# EAGLE design board (EAGLE 6.5.0)
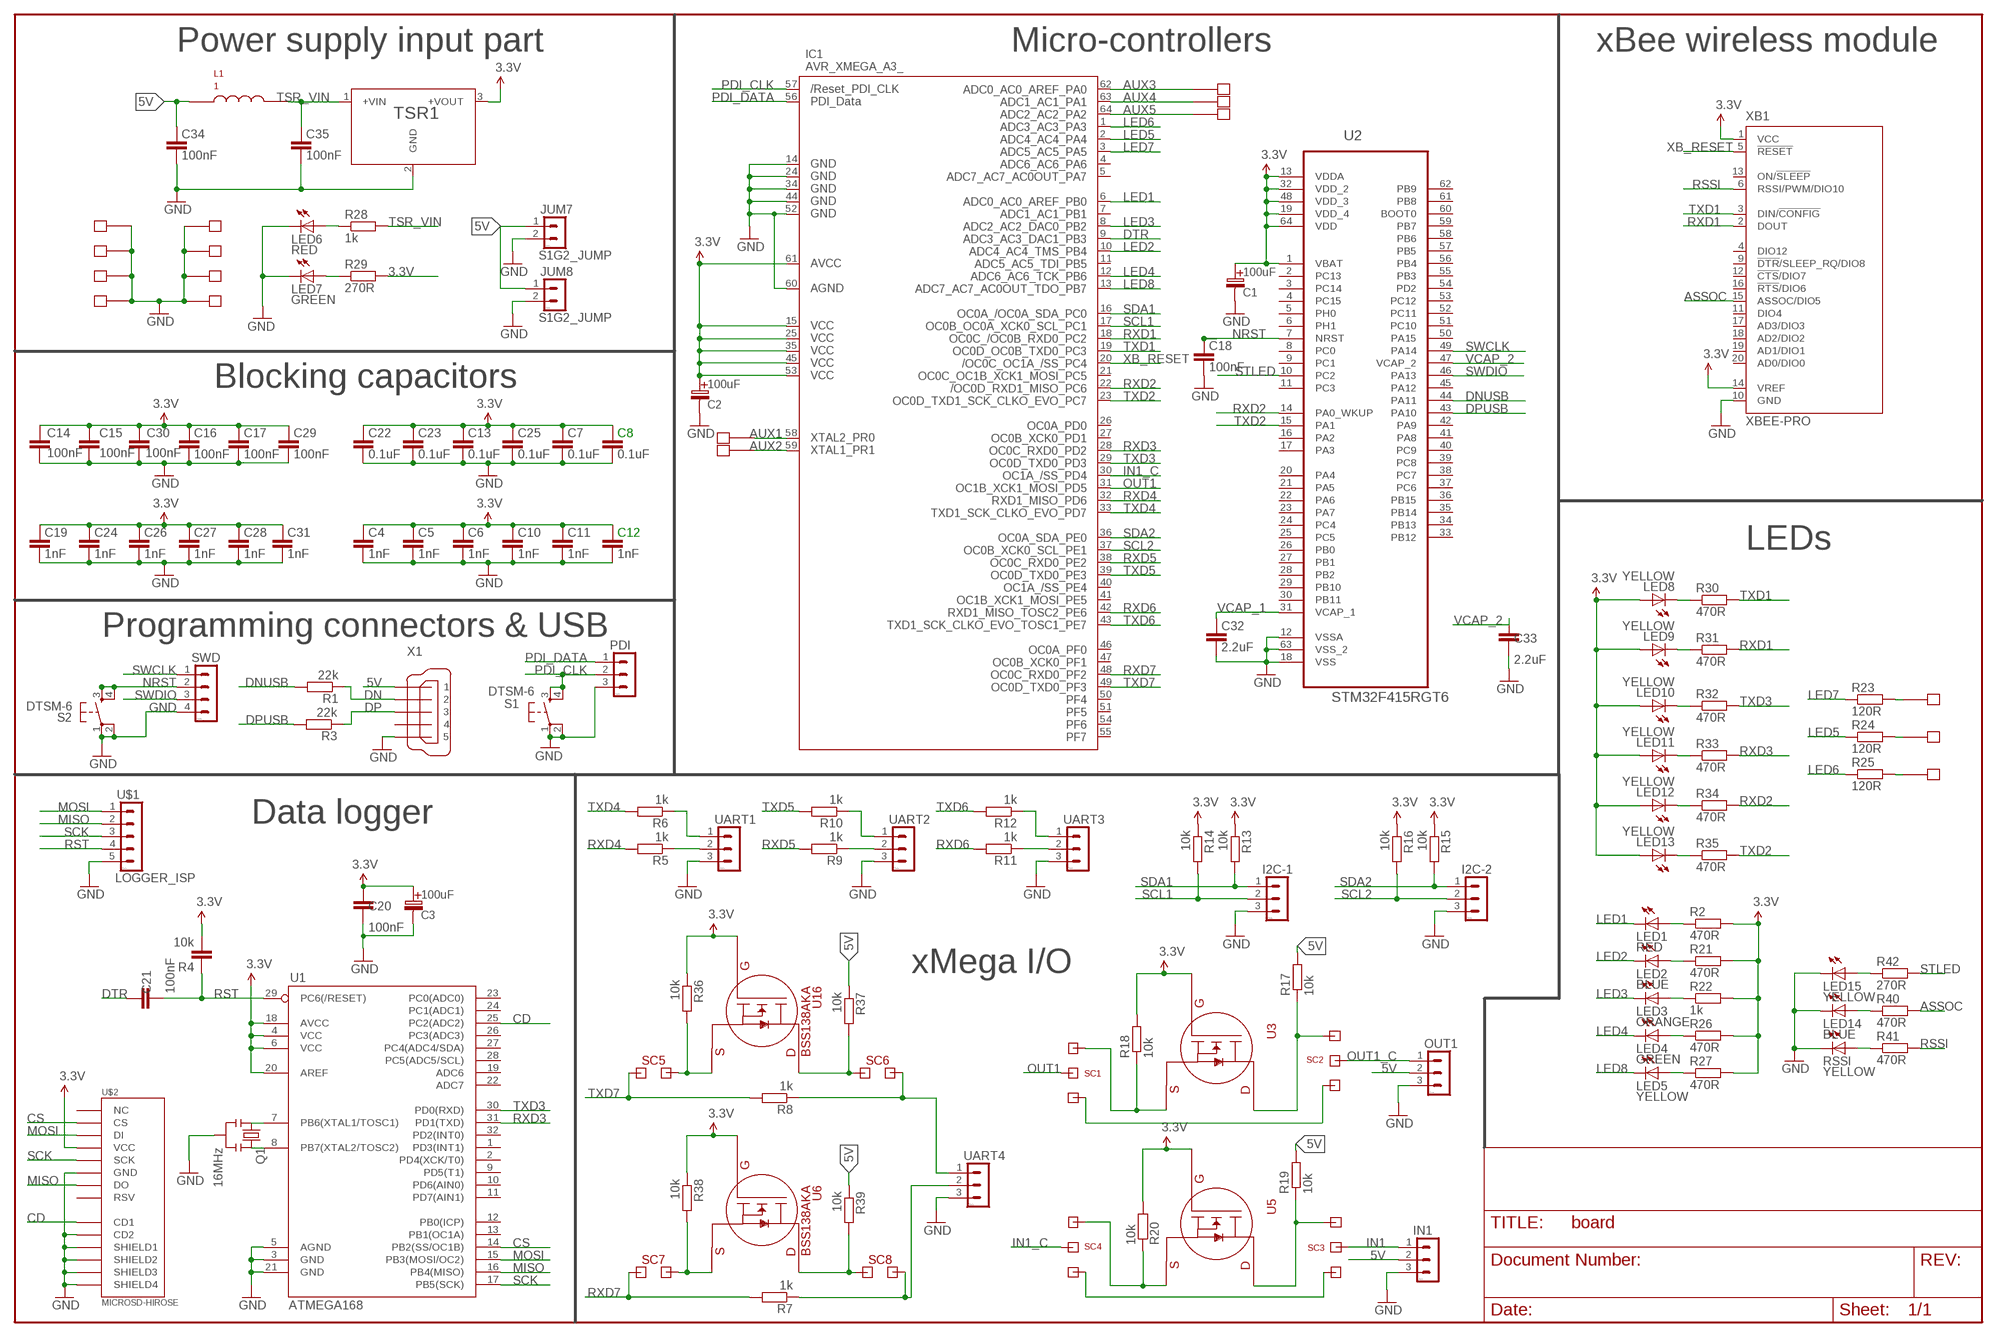
[diagram p0: schematic, sheet 1]

## Parts
AUX1  PIN  [PIN]
AUX2  PIN  [PIN]
AUX3  PIN  [PIN]
AUX4  PIN  [PIN]
AUX5  PIN  [PIN]
C1  100uF  CAPACITOR_TANTAL  [B]
C2  100uF  CAPACITOR_TANTAL  [B]
C3  100uF  CAPACITOR_TANTAL  [B]
C4  1nF  C-EUC0805  [C0805]
C5  1nF  C-EUC0805  [C0805]
C6  1nF  C-EUC0805  [C0805]
C7  0.1uF  C-EUC0805  [C0805]
C8  0.1uF  C-EUC0805  [C0805]
C10  1nF  C-EUC0805  [C0805]
C11  1nF  C-EUC0805  [C0805]
C12  1nF  C-EUC0805  [C0805]
C13  0.1uF  C-EUC0805  [C0805]
C14  100nF  C-EUC0805  [C0805]
C15  100nF  C-EUC0805  [C0805]
C16  100nF  C-EUC0805  [C0805]
C17  100nF  C-EUC0805  [C0805]
C18  100nF  C-EUC0805  [C0805]
C19  1nF  C-EUC0805  [C0805]
C20  100nF  C-EUC0805  [C0805]
C21  100nF  C-EUC0805  [C0805]
C22  0.1uF  C-EUC0805  [C0805]
C23  0.1uF  C-EUC0805  [C0805]
C24  1nF  C-EUC0805  [C0805]
C25  0.1uF  C-EUC0805  [C0805]
C26  1nF  C-EUC0805  [C0805]
C27  1nF  C-EUC0805  [C0805]
C28  1nF  C-EUC0805  [C0805]
C29  100nF  C-EUC0805  [C0805]
C30  100nF  C-EUC0805  [C0805]
C31  1nF  C-EUC0805  [C0805]
C32  2.2uF  C-EUC0805  [C0805]
C33  2.2uF  C-EUC0805  [C0805]
C34  100nF  C-EUC0805  [C0805]
C35  100nF  C-EUC0805  [C0805]
I2C-1  S1G3_JUMP  [S1G3_JUM]
I2C-2  S1G3_JUMP  [S1G3_JUM]
IC1  AVR_XMEGA_A3_  [TQFP64]
IN1  S1G3_JUMP  [S1G3_JUM]
JUM7  S1G2_JUMP  [S1G2_JUM]
JUM8  S1G2_JUMP  [S1G2_JUM]
L1  1  LSDR0604  [SDR0604]
LED1  RED  LEDSML0805  [SML0805]
LED2  BLUE  LEDSML0805  [SML0805]
LED3  ORANGE  LEDSML0805  [SML0805]
LED4  GREEN  LEDSML0805  [SML0805]
LED5  YELLOW  LEDSML0805  [SML0805]
LED6  RED  LEDSML0805  [SML0805]
LED7  GREEN  LEDSML0805  [SML0805]
LED8  YELLOW  LEDSML0805  [SML0805]
LED9  YELLOW  LEDSML0805  [SML0805]
LED10  YELLOW  LEDSML0805  [SML0805]
LED11  YELLOW  LEDSML0805  [SML0805]
LED12  YELLOW  LEDSML0805  [SML0805]
LED13  YELLOW  LEDSML0805  [SML0805]
LED14  BLUE  LEDSML0805  [SML0805]
LED15  YELLOW  LEDSML0805  [SML0805]
OUT1  S1G3_JUMP  [S1G3_JUM]
PDI  S1G3_JUMP  [S1G3_JUM]
Q1  16MHz  RESONATORSMD  [RESONATOR-SMD]
R1  22k  R-EU_R0805  [R0805]
R2  470R  R-EU_R0805  [R0805]
R3  22k  R-EU_R0805  [R0805]
R4  10k  C-EUC0805  [C0805]
R5  1k  R-EU_R0805  [R0805]
R6  1k  R-EU_R0805  [R0805]
R7  1k  R-EU_R0805  [R0805]
R8  1k  R-EU_R0805  [R0805]
R9  1k  R-EU_R0805  [R0805]
R10  1k  R-EU_R0805  [R0805]
R11  1k  R-EU_R0805  [R0805]
R12  1k  R-EU_R0805  [R0805]
R13  10k  R-EU_R0805  [R0805]
R14  10k  R-EU_R0805  [R0805]
R15  10k  R-EU_R0805  [R0805]
R16  10k  R-EU_R0805  [R0805]
R17  10k  R-EU_R0805  [R0805]
R18  10k  R-EU_R0805  [R0805]
R19  10k  R-EU_R0805  [R0805]
R20  10k  R-EU_R0805  [R0805]
R21  470R  R-EU_R0805  [R0805]
R22  1k  R-EU_R0805  [R0805]
R23  120R  R-EU_R0805  [R0805]
R24  120R  R-EU_R0805  [R0805]
R25  120R  R-EU_R0805  [R0805]
R26  470R  R-EU_R0805  [R0805]
R27  470R  R-EU_R0805  [R0805]
R28  1k  R-EU_R0805  [R0805]
R29  270R  R-EU_R0805  [R0805]
R30  470R  R-EU_R0805  [R0805]
R31  470R  R-EU_R0805  [R0805]
R32  470R  R-EU_R0805  [R0805]
R33  470R  R-EU_R0805  [R0805]
R34  470R  R-EU_R0805  [R0805]
R35  470R  R-EU_R0805  [R0805]
R36  10k  R-EU_R0805  [R0805]
R37  10k  R-EU_R0805  [R0805]
R38  10k  R-EU_R0805  [R0805]
R39  10k  R-EU_R0805  [R0805]
R40  470R  R-EU_R0805  [R0805]
R41  470R  R-EU_R0805  [R0805]
R42  270R  R-EU_R0805  [R0805]
RSSI  YELLOW  LEDSML0805  [SML0805]
S1  DTSM-6  [DTSM-6]
S2  DTSM-6  [DTSM-6]
SC1  SOLDER_SWITCH_ONE  [SOLDER_SWITCH]
SC2  SOLDER_SWITCH_TWO  [SOLDER_SWITCH]
SC3  SOLDER_SWITCH_ONE  [SOLDER_SWITCH]
SC4  SOLDER_SWITCH_TWO  [SOLDER_SWITCH]
SC5  SOLDER_SWITCH_2  [SOLDER_SWITCH_2]
SC6  SOLDER_SWITCH_2  [SOLDER_SWITCH_2]
SC7  SOLDER_SWITCH_2  [SOLDER_SWITCH_2]
SC8  SOLDER_SWITCH_2  [SOLDER_SWITCH_2]
SWD  S1G4_JUMP_SQUARE  [2X02]
TSR  TSR1  [TSR1]
U1  ATMEGA168  [TQFP32-08]
U2  STM32F415RGT6  [QFP50P1200X1200X160-64N]
U3  BSS138AKA  [SOT-23]
U5  BSS138AKA  [SOT-23]
U6  BSS138AKA  [SOT-23]
U16  BSS138AKA  [SOT-23]
U$1  LOGGER_ISP  [LOGGER_ISP]
U$2  MICROSD-HIROSE  [MICROSD_HOLDER-HIROSE-DM3AT]
U$10  PIN  [PIN]
U$11  PIN  [PIN]
U$12  PIN  [PIN]
U$15  PIN  [PIN]
U$16  PIN  [PIN]
U$17  PIN  [PIN]
U$18  PIN  [PIN]
U$19  PIN  [PIN]
U$20  PIN  [PIN]
U$21  PIN  [PIN]
U$22  PIN  [PIN]
UART1  S1G3_JUMP  [S1G3_JUM]
UART2  S1G3_JUMP  [S1G3_JUM]
UART3  S1G3_JUMP  [S1G3_JUM]
UART4  S1G3_JUMP  [S1G3_JUM]
X1  MINI-USB-UX60A-MB-5ST  [UX60A-MB-5ST]
XB1  XBEE-PRO  [XBEE-PRO]

## Nets
3.3V: C1.+(C_EL+) C2.+(C_EL+) C3.+(C_EL+) C4.2 C5.2 C6.2 C7.2 C8.2 C10.2 C11.2 C12.2 C13.2 C14.2 C15.2 C16.2 C17.2 C19.2 C20.2 C22.2 C23.2 C24.2 C25.2 C26.2 C27.2 C28.2 C29.2 C30.2 C31.2 IC1.15(VCC1) IC1.25(VCC2) IC1.35(VCC3) IC1.45(VCC4) IC1.53(VCC5) IC1.61(AVCC) LED8.A LED9.A LED10.A LED11.A LED12.A LED13.A R2.2 R4.2 R13.1 R14.1 R15.1 R16.1 R18.2 R20.2 R21.2 R22.2 R26.2 R27.2 R29.2 R36.1 R38.1 TSR.3(+VOUT) U1.4(VCC) U1.6(VCC) U1.18(AVCC) U1.20(AREF) U2.1(VBAT) U2.13(VDDA) U2.19(VDD_4) U2.32(VDD_2) U2.48(VDD_3) U2.64(VDD) U3.1(G) U5.1(G) U6.1(G) U16.1(G) U$2.VDD(VCC) XB1.1(VCC) XB1.14(VREF)
5V: C34.2 IN1.2 JUM7.1 JUM8.1 L1.P$1 OUT1.2 R17.2 R19.2 R37.1 R39.1 X1.1
ASSOC: R40.2 XB1.15(ASSOC/DIO5)
AUX1: AUX1.P$1(D) IC1.58(PR0)
AUX2: AUX2.P$1(D) IC1.59(PR1)
AUX3: AUX3.P$1(D) IC1.62(PA0)
AUX4: AUX4.P$1(D) IC1.63(PA1)
AUX5: AUX5.P$1(D) IC1.64(PA2)
CD: U1.25(PC2(ADC2)) U$2.CD1
CS: U1.14(PB2(SS/OC1B)) U$2.DAT3(CS)
DN: R1.1 X1.2
DNUSB: R1.2 U2.44(PA11)
DP: R3.1 X1.3
DPUSB: R3.2 U2.43(PA10)
DTR: C21.2 IC1.9(PB3)
GND [vcc]: C1.-(C_EL-) C2.-(C_EL-) C3.-(C_EL-) C4.1 C5.1 C6.1 C7.1 C8.1 C10.1 C11.1 C12.1 C13.1 C14.1 C15.1 C16.1 C17.1 C18.1 C19.1 C20.1 C22.1 C23.1 C24.1 C25.1 C26.1 C27.1 C28.1 C29.1 C30.1 C31.1 C32.1 C33.1 C34.1 C35.1 I2C-1.3 I2C-2.3 IC1.14(GND1) IC1.24(GND2) IC1.34(GND3) IC1.44(GND4) IC1.52(GND5) IC1.60(AGND) IN1.3 JUM7.2 JUM8.2 LED6.C LED7.C LED14.C LED15.C OUT1.3 PDI.3 Q1.2 RSSI.C S1.1 S1.2 S2.1 S2.2 SWD.4 TSR.2(GND) U1.3(GND) U1.5(AGND) U1.21(GND) U2.12(VSSA) U2.18(VSS) U2.63(VSS_2) U$1.5 U$2.BODY1(SHIELD1) U$2.BODY2(SHIELD2) U$2.BODY3(SHIELD3) U$2.BODY4(SHIELD4) U$2.CD2 U$2.VSS(GND) U$15.P$1(D) U$16.P$1(D) U$17.P$1(D) U$18.P$1(D) U$19.P$1(D) U$20.P$1(D) U$21.P$1(D) U$22.P$1(D) UART1.3 UART2.3 UART3.3 UART4.3 X1.5 XB1.10(GND)
IN1: IN1.1 SC3.MID
IN1_C: IC1.30(PD4) SC4.MID
LED1: IC1.6(PB0) LED1.C
LED2: IC1.10(PB4) LED2.C
LED3: IC1.8(PB2) LED3.C
LED4: IC1.12(PB6) LED4.C
LED5: IC1.2(PA4) R24.1
LED6: IC1.1(PA3) R25.1
LED7: IC1.3(PA5) R23.1
LED8: IC1.13(PB7) LED5.C
MISO: U1.16(PB4(MISO)) U$1.2 U$2.DAT0(DO)
MOSI: U1.15(PB3(MOSI/OC2)) U$1.1 U$2.CMD(DI)
N$1: Q1.3 U1.8(PB7(XTAL2/TOSC2))
N$2: Q1.1 U1.7(PB6(XTAL1/TOSC1))
N$3: LED1.A R2.1
N$4: R25.2 U$12.P$1(D)
N$5: R5.1 UART1.2
N$6: R6.1 UART1.1
N$7: LED3.A R22.1
N$8: R17.1 SC2.1 U3.3(D)
N$9: R18.1 SC1.1 U3.2(S)
N$10: R10.1 UART2.1
N$11: R9.1 UART2.2
N$12: R12.1 UART3.1
N$13: R11.1 UART3.2
N$14: LED8.C R30.1
N$15: R20.1 SC4.1 U5.2(S)
N$16: R36.2 SC5.1 U16.2(S)
N$17: LED6.A R28.1
N$18: LED2.A R21.1
N$19: LED7.A R29.1
N$20: LED4.A R26.1
N$21: LED9.C R31.1
N$22: R38.2 SC7.1 U6.2(S)
N$23: R37.2 SC6.MID U16.3(D)
N$24: LED10.C R32.1
N$25: R39.2 SC8.MID U6.3(D)
N$26: LED11.C R33.1
N$27: LED12.C R34.1
N$28: LED13.C R35.1
N$29: LED5.A R27.1
N$30: R19.1 SC3.1 U5.3(D)
N$31: SC3.2 SC4.2
N$32: R23.2 U$10.P$1(D)
N$33: LED14.A R40.1
N$34: SC1.2 SC2.2
N$35: R41.1 RSSI.A
N$36: R24.2 U$11.P$1(D)
N$37: LED15.A R42.1
NRST: C18.2 S2.3 S2.4 SWD.2 U2.7(NRST)
OUT1: IC1.31(PD5) SC1.MID
OUT1_C: OUT1.1 SC2.MID
PDI_CLK: IC1.57(RESET) PDI.2 S1.3 S1.4
PDI_DATA: IC1.56(PDI_DATA) PDI.1
RSSI: R41.2 XB1.6(RSSI/PWM/DIO10)
RST: C21.1 R4.1 U1.29(PC6(/RESET)) U$1.4
RXD1: IC1.18(PC2) R31.2 XB1.2(DOUT)
RXD2: IC1.22(PC6) R34.2 U2.14(PA0_WKUP)
RXD3: IC1.28(PD2) R33.2 U1.31(PD1(TXD))
RXD4: IC1.32(PD6) R5.2
RXD5: IC1.38(PE2) R9.2
RXD6: IC1.42(PE6) R11.2
RXD7: IC1.48(PF2) R7.2 SC7.MID
RXD77: R7.1 SC8.1 UART4.2
SCK: U1.17(PB5(SCK)) U$1.3 U$2.CLK(SCK)
SCL1: I2C-1.2 IC1.17(PC1) R14.2
SCL2: I2C-2.2 IC1.37(PE1) R16.2
SDA1: I2C-1.1 IC1.16(PC0) R13.2
SDA2: I2C-2.1 IC1.36(PE0) R15.2
STLED: R42.2 U2.10(PC2)
SWCLK: SWD.1 U2.49(PA14)
SWDIO: SWD.3 U2.46(PA13)
TSR_VIN: C35.2 L1.P$2 R28.2 TSR.1(+VIN)
TXD1: IC1.19(PC3) R30.2 XB1.3(DIN/!CONFIG)
TXD2: IC1.23(PC7) R35.2 U2.15(PA1)
TXD3: IC1.29(PD3) R32.2 U1.30(PD0(RXD))
TXD4: IC1.33(PD7) R6.2
TXD5: IC1.39(PE3) R10.2
TXD6: IC1.43(PE7) R12.2
TXD7: IC1.49(PF3) R8.2 SC5.MID
TXD77: R8.1 SC6.1 UART4.1
VCAP_1: C32.2 U2.31(VCAP_1)
VCAP_2: C33.2 U2.47(VCAP_2)
XB_RESET: IC1.20(PC4) XB1.5(!RESET)
Unconnected: IC1.4(PA6) IC1.5(PA7) IC1.7(PB1) IC1.11(PB5) IC1.21(PC5) IC1.26(PD0) IC1.27(PD1) IC1.40(PE4) IC1.41(PE5) IC1.46(PF0) IC1.47(PF1) IC1.50(PF4) IC1.51(PF5) IC1.54(PF6) IC1.55(PF7) U1.1(PD3(INT1)) U1.2(PD4(XCK/T0)) U1.9(PD5(T1)) U1.10(PD6(AIN0)) U1.11(PD7(AIN1)) U1.12(PB0(ICP)) U1.13(PB1(OC1A)) U1.19(ADC6) U1.22(ADC7) U1.23(PC0(ADC0)) U1.24(PC1(ADC1)) U1.26(PC3(ADC3)) U1.27(PC4(ADC4/SDA)) U1.28(PC5(ADC5/SCL)) U1.32(PD2(INT0)) U2.2(PC13) U2.3(PC14) U2.4(PC15) U2.5(PH0) U2.6(PH1) U2.8(PC0) U2.9(PC1) U2.11(PC3) U2.16(PA2) U2.17(PA3) U2.20(PA4) U2.21(PA5) U2.22(PA6) U2.23(PA7) U2.24(PC4) U2.25(PC5) U2.26(PB0) U2.27(PB1) U2.28(PB2) U2.29(PB10) U2.30(PB11) U2.33(PB12) U2.34(PB13) U2.35(PB14) U2.36(PB15) U2.37(PC6) U2.38(PC7) U2.39(PC8) U2.40(PC9) U2.41(PA8) U2.42(PA9) U2.45(PA12) U2.50(PA15) U2.51(PC10) U2.52(PC11) U2.53(PC12) U2.54(PD2) U2.55(PB3) U2.56(PB4) U2.57(PB5) U2.58(PB6) U2.59(PB7) U2.60(BOOT0) U2.61(PB8) U2.62(PB9) U$2.DAT1(RSV) U$2.DAT2(NC) X1.4 XB1.4(DIO12) XB1.9(!DTR!/SLEEP_RQ/DIO8) XB1.11(DIO4) XB1.12(!CTS!/DIO7) XB1.13(ON/!SLEEP) XB1.16(!RTS!/DIO6) XB1.17(AD3/DIO3) XB1.18(AD2/DIO2) XB1.19(AD1/DIO1) XB1.20(AD0/DIO0)

## Notes on the sheet
- Power supply input part | Micro-controllers | xBee wireless module
- Blocking capacitors
- LEDs
- Programming connectors & USB
- Data logger
- xMega I/O

## Library data of the parts
AUX1-AUX5 U$10-U$12 U$15-U$22 = #ControlBoardV2:PIN
C1-C3 = #ControlBoardV2:CAPACITOR_TANTAL
C4-C8 C10-C35 R4 = #ControlBoardV2:C-EU: CAPACITOR, European symbol
I2C-1 I2C-2 IN1 OUT1 PDI UART1-UART4 = #ControlBoardV2:S1G3_JUMP: Radove konektory - koliky - 3x
IC1 = xmega:AVR_XMEGA_A3_: Device for Atmel AVR XMEGA A3 Series
JUM7 JUM8 = #ControlBoardV1:S1G2_JUMP: Radove konektory - koliky - 2x
L1 = #ControlBoardV2:L
LED1-LED15 RSSI = #ControlBoardV1:LED: LED OSRAM: - CHIPLED LG R971, LG N971, LY N971, LG Q971, LY Q971, LO R971, LY R971 LH N974, LH R974 LS Q976, LO Q976, LY Q976 LO Q996 - Hyper CHIPLED LW Q18S LB Q993, LB Q99A, LB R99A - SideLED LS A670, LO A670, LY A670, LG A670, LP A670 LB A673, LV A673, LT A673, LW A673 LH A674 LY A675 LS A676, LA A676, LO A676, LY A676, LW A676 LS A679, LY A679, LG A679 - Hyper Micro SIDELED® LS Y876, LA Y876, LO Y876, LY Y876 LT Y87S - SmartLED LW L88C, LW L88S LB L89C, LB L89S, LG L890 LS L89K, LO L89K, LY L89K LS L896, LA L896, LO L896, LY L896 - TOPLED LS T670, LO T670, LY T670, LG T670, LP T670 LSG T670, LSP T670, LSY T670, LOP T670, LYG T670 LG T671, LOG T671, LSG T671 LB T673, LV T673, LT T673, LW T673 LH T674 LS T676, LA T676, LO T676, LY T676, LB T676, LH T676, LSB T676, LW T676 LB T67C, LV T67C, LT T67C, LS T67K, LO T67K, LY T67K, LW E67C LS E67B, LA E67B, LO E67B, LY E67B, LB E67C, LV E67C, LT E67C LW T67C LS T679, LY T679, LG T679 LS T770, LO T770, LY T770, LG T770, LP T770 LB T773, LV T773, LT T773, LW T773 LH T774 LS E675, LA E675, LY E675, LS T675 LS T776, LA T776, LO T776, LY T776, LB T776 LHGB T686 LT T68C, LB T68C - Hyper Mini TOPLED® LB M676 - Mini TOPLED Santana® LG M470 LS M47K, LO M47K, LY M47K Source: http://www.osram.convergy.de LUXEON: - LUMILED® LXK2-PW12-R00, LXK2-PW12-S00, LXK2-PW14-U00, LXK2-PW14-V00 LXK2-PM12-R00, LXK2-PM12-S00, LXK2-PM14-U00 LXK2-PE12-Q00, LXK2-PE12-R00, LXK2-PE12-S00, LXK2-PE14-T00, LXK2-PE14-U00 LXK2-PB12-K00, LXK2-PB12-L00, LXK2-PB12-M00, LXK2-PB14-N00, LXK2-PB14-P00, LXK2-PB14-Q00 LXK2-PR12-L00, LXK2-PR12-M00, LXK2-PR14-Q00, LXK2-PR14-R00 LXK2-PD12-Q00, LXK2-PD12-R00, LXK2-PD12-S00 LXK2-PH12-R00, LXK2-PH12-S00 LXK2-PL12-P00, LXK2-PL12-Q00, LXK2-PL12-R00 Source: www.luxeon.com KINGBRIGHT: KA-3528ASYC Source: www.kingbright.com
Q1 = #SparkFun:RESONATOR: Resonator Small SMD resonator. This is the itty bitty 10/20MHz resonators with built in caps. CSTCE10M0G55 and CSTCE20M0V53. Footprint has been reviewed closely but hasn't been tested yet.
R1-R3 R5-R42 = #ControlBoardV2:R-EU_: RESISTOR, European symbol
S1 S2 = #ControlBoardV1:DTSM-6
SC1-SC4 = #ControlBoardV2:SOLDER_SWITCH
SC5-SC8 = #ControlBoardV2:SOLDER_SWITCH_2
SWD = #ControlBoardV2:S1G4_JUMP: Radove konektory - koliky - 4x
TSR = #ControlBoardV2:TSR1
U1 = SparkFun:ATMEGA168
U2 = #ControlBoardV2:STM32F415RGT6: IC, MCU, 32BIT, 1MB FLASH, 64LQFP; MPN: STM32F415RGT6; OC_FARNELL: 2064370; OC_NEWARK: 73T2335; PACKAGE: 64LQFP; SUPPLIER: STMicroelectronics
U3 U5 = #ControlBoardV2:BSS138AKA: N MOSFET
U6 U16 = medipix:BSS138AKA: N MOSFET
U$1 = #ControlBoardV2:LOGGER_ISP: ISP programming interface for data logger
U$2 = basestation1:MICROSD-HIROSE
X1 = #ControlBoardV2:MINI-USB-: MINI USB Connector Source: http://www.hirose.co.jp/cataloge_hp/e24000019.pdf; OC_FARNELL: unknown; OC_NEWARK: unknown
XB1 = xbee:XBEE: XBee (TM) /XBee-PRO(TM) OEM RF Modules Source: MaxStream, Inc. xbee_productmanual.pdf; MPN: XBP24-AWI-001; OC_FARNELL: 1337916; OC_NEWARK: 42M2667

## Net classes
1 vcc: width 0.203 mm

## Board
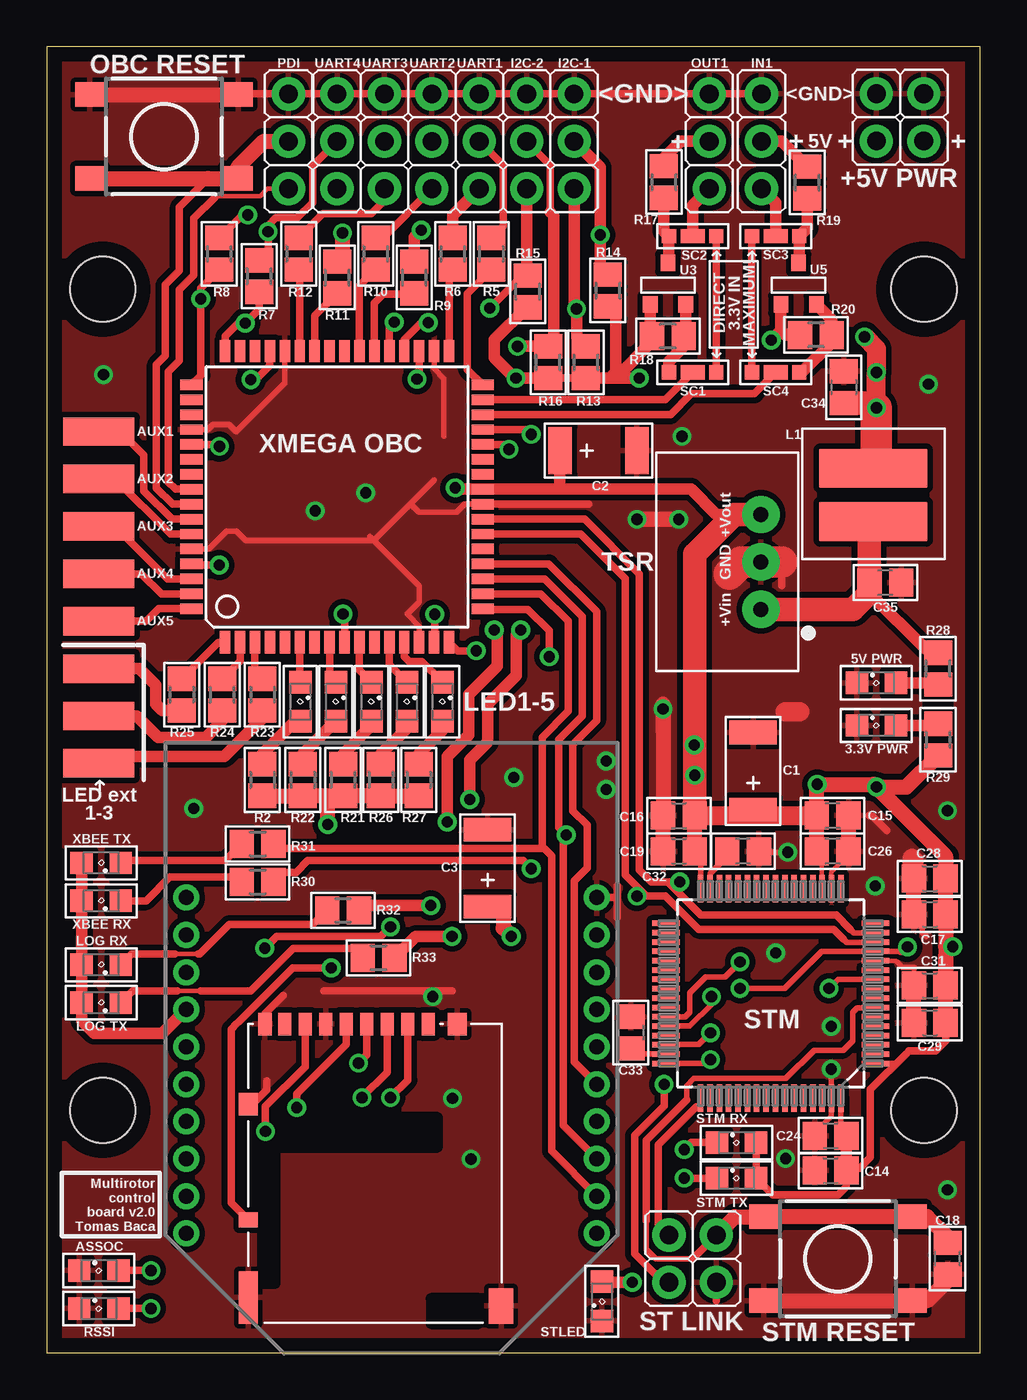
[diagram p1: board, top side]
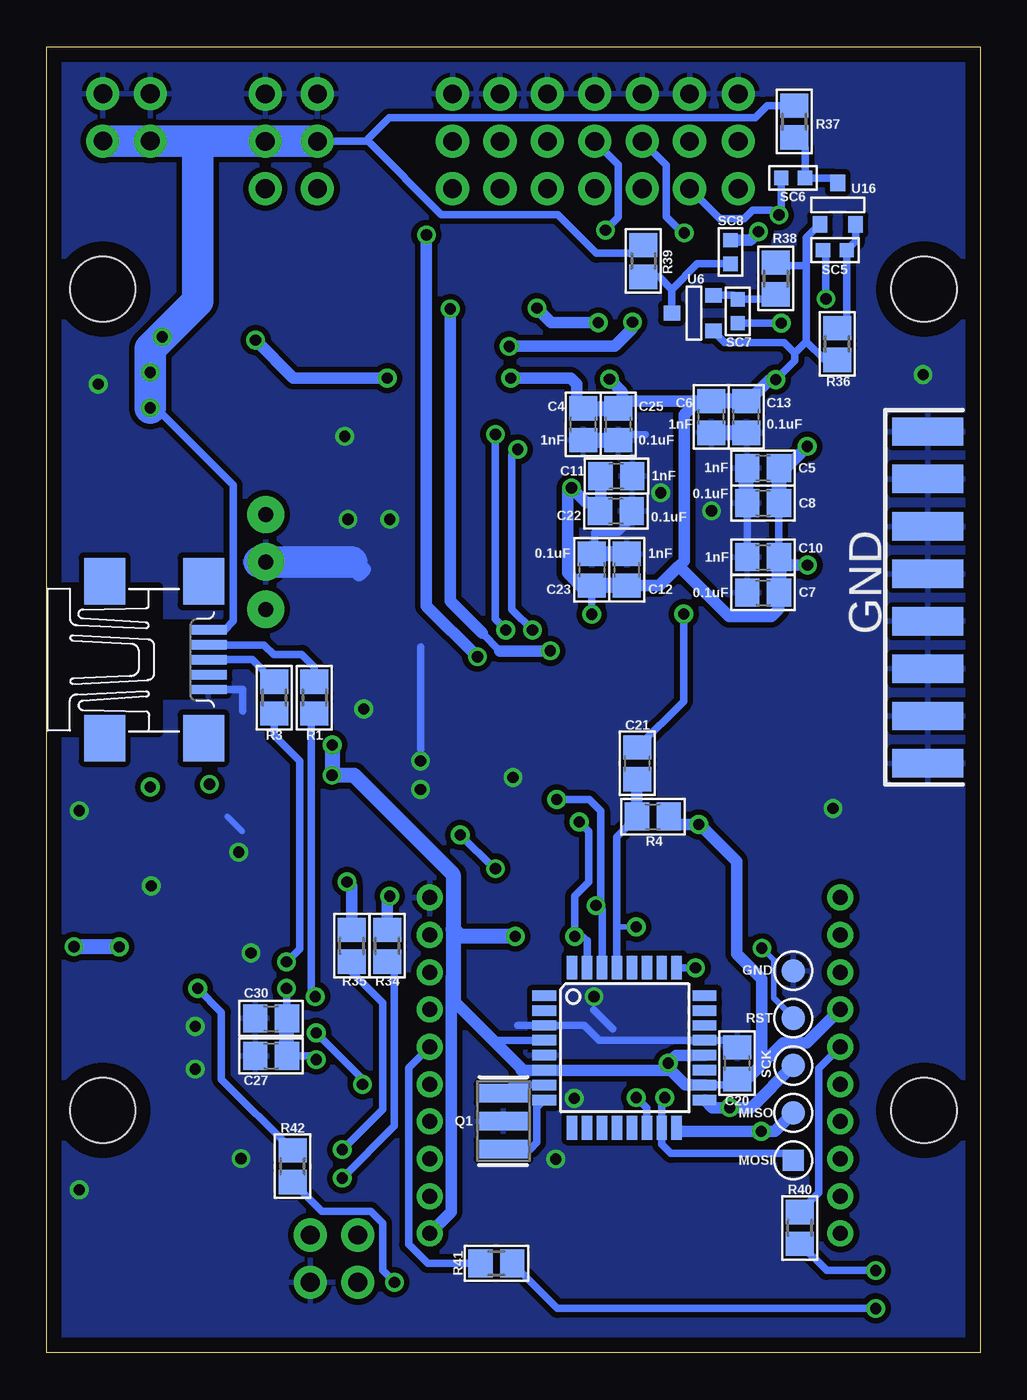
[diagram p2: board, bottom side, seen from below]

Size 50 x 70 mm. Coordinates in mm from the lower left corner, seen from the top.
Outline: 0,0 50,0 50,70 0,70 0,0
Copper layers (1*16): Top 0.035mm / dielectric 1.5mm / Bottom 0.035mm
Design rules "default *": minimum track width 0.15mm, minimum drill 0.2mm, track to track 0.15mm, track to pad 0.15mm, pad to pad 0.15mm, via to via 0.3mm, smd to smd 0.15mm, copper to edge 0.8mm, drill to drill 0.8mm, minimum pad ring 10mil, minimum via ring 8mil, stop-mask expansion 4mil, vias tented up to drill 0mil, thermal gap 10mil
Holes 3.5 mm at 3,13 47,13 47,57 3,57

### Footprints (pad centres in the part's own frame; a part is rotated, then mirrored left to right if it is on the bottom)
PIN = smd 1.524 x 3.81: P$1 0,0
B = smd 1.27 x 2.54: + 2.223,0; - -1.905,0
C0805 = smd 1.3 x 1.5: 1 -0.85,0; 2 0.85,0
S1G3_JUM = drill 1 pad 1.778: 1 -2.54,0; 2 0,0; 3 2.54,0
TQFP64 = smd 1.194 x 0.559: 1 -7.8,6; 2 -7.8,5.2; 3 -7.8,4.4; 4 -7.8,3.6; 5 -7.8,2.8; 6 -7.8,2; 7 -7.8,1.2; 8 -7.8,0.4; 9 -7.8,-0.4; 10 -7.8,-1.2; 11 -7.8,-2; 12 -7.8,-2.8; 13 -7.8,-3.6; 14 -7.8,-4.4; 15 -7.8,-5.2; 16 -7.8,-6; 33 7.8,-6; 34 7.8,-5.2; 35 7.8,-4.4; 36 7.8,-3.6; 37 7.8,-2.8; 38 7.8,-2; 39 7.8,-1.2; 40 7.8,-0.4; 41 7.8,0.4; 42 7.8,1.2; 43 7.8,2; 44 7.8,2.8; 45 7.8,3.6; 46 7.8,4.4; 47 7.8,5.2; 48 7.8,6 | smd 0.559 x 1.194: 17 -6,-7.8; 18 -5.2,-7.8; 19 -4.4,-7.8; 20 -3.6,-7.8; 21 -2.8,-7.8; 22 -2,-7.8; 23 -1.2,-7.8; 24 -0.4,-7.8; 25 0.4,-7.8; 26 1.2,-7.8; 27 2,-7.8; 28 2.8,-7.8; 29 3.6,-7.8; 30 4.4,-7.8; 31 5.2,-7.8; 32 6,-7.8; 49 6,7.8; 50 5.2,7.8; 51 4.4,7.8; 52 3.6,7.8; 53 2.8,7.8; 54 2,7.8; 55 1.2,7.8; 56 0.4,7.8; 57 -0.4,7.8; 58 -1.2,7.8; 59 -2,7.8; 60 -2.8,7.8; 61 -3.6,7.8; 62 -4.4,7.8; 63 -5.2,7.8; 64 -6,7.8
S1G2_JUM = drill 1 pad 1.778: 1 -1.27,0; 2 1.27,0
SDR0604 = smd 5.8 x 2.1: P$1 0,1.05; P$2 0,-1.8
SML0805 = smd 1.2 x 1.2: A 1.05,0; C -1.05,0
RESONATOR-SMD = smd 1 x 2.6: 1 -1.5,0; 2 0,0; 3 1.5,0
R0805 = smd 1.3 x 1.5: 1 -0.85,0; 2 0.85,0
DTSM-6 = smd 1.55 x 1.3: 1 -3.975,2.25; 2 3.975,2.25; 3 -3.975,-2.25; 4 3.975,-2.25
SOLDER_SWITCH = smd 0.762 x 0.762: 1 -1.27,0; 2 1.27,0 | smd 1.27 x 0.762: MID 0,0
SOLDER_SWITCH_2 = smd 0.762 x 0.762: 1 -1.27,0; MID 0,0
2X02 = drill 1 pad 1.778: 1 -1.27,-1.27; 2 -1.27,1.27; 3 1.27,-1.27; 4 1.27,1.27
TSR1 = drill 0.8 pad 2: 1 -2.54,0; 2 0,0; 3 2.54,0
TQFP32-08 = smd 1.27 x 0.559: 1 -4.293,2.8; 2 -4.293,2; 3 -4.293,1.2; 4 -4.293,0.4; 5 -4.293,-0.4; 6 -4.293,-1.2; 7 -4.293,-2; 8 -4.293,-2.8; 17 4.293,-2.8; 18 4.293,-2; 19 4.293,-1.2; 20 4.293,-0.4; 21 4.293,0.4; 22 4.293,1.2; 23 4.293,2; 24 4.293,2.8 | smd 0.559 x 1.27: 9 -2.8,-4.293; 10 -2,-4.293; 11 -1.2,-4.293; 12 -0.4,-4.293; 13 0.4,-4.293; 14 1.2,-4.293; 15 2,-4.293; 16 2.8,-4.293; 25 2.8,4.293; 26 2,4.293; 27 1.2,4.293; 28 0.4,4.293; 29 -0.4,4.293; 30 -1.2,4.293; 31 -2,4.293; 32 -2.8,4.293
QFP50P1200X1200X160-64N = smd 1.473 x 0.279: 1 -5.613,3.759; 2 -5.613,3.251; 3 -5.613,2.743; 4 -5.613,2.261; 5 -5.613,1.753; 6 -5.613,1.245; 7 -5.613,0.762; 8 -5.613,0.254; 9 -5.613,-0.254; 10 -5.613,-0.762; 11 -5.613,-1.245; 12 -5.613,-1.753; 13 -5.613,-2.261; 14 -5.613,-2.743; 15 -5.613,-3.251; 16 -5.613,-3.759; 33 5.613,-3.759; 34 5.613,-3.251; 35 5.613,-2.743; 36 5.613,-2.261; 37 5.613,-1.753; 38 5.613,-1.245; 39 5.613,-0.762; 40 5.613,-0.254; 41 5.613,0.254; 42 5.613,0.762; 43 5.613,1.245; 44 5.613,1.753; 45 5.613,2.261; 46 5.613,2.743; 47 5.613,3.251; 48 5.613,3.759 | smd 0.279 x 1.473: 17 -3.759,-5.613; 18 -3.251,-5.613; 19 -2.743,-5.613; 20 -2.261,-5.613; 21 -1.753,-5.613; 22 -1.245,-5.613; 23 -0.762,-5.613; 24 -0.254,-5.613; 25 0.254,-5.613; 26 0.762,-5.613; 27 1.245,-5.613; 28 1.753,-5.613; 29 2.261,-5.613; 30 2.743,-5.613; 31 3.251,-5.613; 32 3.759,-5.613; 49 3.759,5.613; 50 3.251,5.613; 51 2.743,5.613; 52 2.261,5.613; 53 1.753,5.613; 54 1.245,5.613; 55 0.762,5.613; 56 0.254,5.613; 57 -0.254,5.613; 58 -0.762,5.613; 59 -1.245,5.613; 60 -1.753,5.613; 61 -2.261,5.613; 62 -2.743,5.613; 63 -3.251,5.613; 64 -3.759,5.613
SOT-23 = smd 0.787 x 0.889: 1 -0.953,-0.953; 2 0.953,-0.953; 3 0,1.27
LOGGER_ISP = smd 1.118 x 1.118: 1 0,0 | smd 1.27 x 1.27: 2 2.54,0; 3 5.08,0; 4 7.62,0; 5 10.16,0
MICROSD_HOLDER-HIROSE-DM3AT = smd 1 x 2.8: BODY1 -6.35,-14.65 | smd 1 x 1.2: BODY2 -6.35,-4.3; BODY4 4.85,0 | smd 1.3 x 1.9: BODY3 7.2,-15.1 | smd 1 x 0.8: CD1 -6.35,-10.5 | smd 0.7 x 1.2: CD2 -5.45,0; CLK -1.1,0; CMD 1.1,0; DAT0 -3.3,0; DAT1 -4.4,0; DAT2 3.3,0; DAT3 2.2,0; VDD 0,0; VSS -2.2,0
UX60A-MB-5ST = smd 2 x 0.5: 1 2.25,1.6; 2 2.25,0.8; 3 2.25,0; 4 2.25,-0.8; 5 2.25,-1.6 | smd 2.2 x 2.5: M1 -3.3,-4.2; M2 -3.3,4.2; M3 2,4.2; M4 2,-4.2
XBEE-PRO = drill 0.8 pad 1.397: 1 -11,9; 2 -11,7; 3 -11,5; 4 -11,3; 5 -11,1; 6 -11,-1; 7 -11,-3; 8 -11,-5; 9 -11,-7; 10 -11,-9; 11 11,-9; 12 11,-7; 13 11,-5; 14 11,-3; 15 11,-1; 16 11,1; 17 11,3; 18 11,5; 19 11,7; 20 11,9

### Placement (x,y rotation side)
AUX1  2.79,49.37 270 top
AUX2  2.79,46.83 270 top
AUX3  2.79,44.29 270 top
AUX4  2.79,41.75 270 top
AUX5  2.79,39.21 270 top
C1  37.85,31.34 270 top
C2  29.72,48.35 180 top
C3  23.62,26.13 270 top
C4  21.26,49.77 90 bottom
C5  11.62,47.42 0 bottom
C6  14.4,50.16 90 bottom
C7  11.62,40.74 0 bottom
C8  11.62,45.54 0 bottom
C10  11.62,42.64 0 bottom
C11  19.48,46.98 180 bottom
C12  18.93,41.96 270 bottom
C13  12.52,50.15 90 bottom
C14  42,9.77 0 top
C15  42.11,28.79 180 top
C16  33.87,28.79 0 top
C17  47.31,23.49 0 top
C18  48.26,5.05 90 top
C19  33.87,26.88 0 top
C20  13.02,15.52 270 bottom
C21  18.35,31.59 90 bottom
C22  19.5,45.1 180 bottom
C23  20.8,41.96 270 bottom
C24  42,11.64 0 top
C25  19.37,49.77 90 bottom
C26  42.11,26.88 180 top
C27  37.98,15.91 0 bottom
C28  47.31,25.42 0 top
C29  47.31,17.68 0 top
C30  37.98,17.91 0 bottom
C31  47.31,19.68 0 top
C32  37.31,26.88 180 top
C33  31.29,17.16 270 top
C34  42.7,51.75 270 top
C35  44.93,41.27 180 top
I2C-1  28.26,64.93 90 top
I2C-2  25.72,64.93 90 top
IC1  15.56,45.88 90 top
IN1  38.29,64.93 90 top
JUM7  44.45,66.21 90 top
JUM8  46.99,66.21 90 top
L1  44.29,46.35 0 top
LED1  13.59,34.89 270 top
LED2  17.4,34.89 270 top
LED3  15.49,34.89 270 top
LED4  19.3,34.89 270 top
LED5  21.21,34.89 270 top
LED6  44.45,35.91 0 top
LED7  44.45,33.62 0 top
LED8  2.92,24.22 180 top
LED9  2.92,26.26 180 top
LED10  2.92,20.8 180 top
LED11  2.92,18.76 180 top
LED12  36.96,9.37 0 top
LED13  36.96,11.27 0 top
LED14  2.79,4.41 0 top
LED15  29.74,2.76 90 top
OUT1  35.5,64.93 90 top
PDI  12.95,64.93 90 top
Q1  25.53,12.41 270 bottom
R1  35.66,35.11 270 bottom
R2  11.56,30.7 270 top
R3  37.81,35.11 270 bottom
R4  17.53,28.73 0 bottom
R5  23.81,58.9 270 top
R6  21.75,58.9 270 top
R7  11.38,57.7 270 top
R8  9.24,58.9 270 top
R9  19.68,57.62 270 top
R10  17.62,58.9 270 top
R11  15.56,57.62 270 top
R12  13.49,58.9 270 top
R13  28.89,53.08 90 top
R14  30.07,56.93 90 top
R15  25.77,56.88 90 top
R16  26.86,53.08 90 top
R17  33.07,62.74 90 top
R18  33.27,54.49 180 top
R19  40.75,62.71 90 top
R20  41.21,54.55 180 top
R21  15.88,30.7 270 top
R22  13.72,30.7 270 top
R23  11.56,35.27 270 top
R24  9.4,35.27 270 top
R25  7.24,35.27 270 top
R26  17.91,30.7 270 top
R27  19.94,30.7 270 top
R28  47.75,36.67 90 top
R29  47.75,32.86 270 top
R30  11.3,25.24 0 top
R31  11.3,27.27 0 top
R32  15.88,23.72 0 top
R33  17.78,21.18 0 top
R34  31.75,21.81 90 bottom
R35  33.66,21.81 90 bottom
R36  7.65,54.07 90 bottom
R37  9.96,65.98 270 bottom
R38  10.95,57.57 270 bottom
R39  18.03,58.51 270 bottom
R40  9.65,6.7 90 bottom
R41  25.91,4.79 180 bottom
R42  36.83,10 90 bottom
RSSI  2.79,2.38 0 top
S1  6.29,65.18 0 top
S2  42.39,5.05 180 top
SC1  34.61,52.55 0 top
SC2  34.61,59.85 0 top
SC3  39.05,59.85 180 top
SC4  39.05,52.55 180 top
SC5  8.41,59.1 180 bottom
SC6  9.37,62.96 0 bottom
SC7  12.98,55.19 270 bottom
SC8  13.36,58.36 270 bottom
SWD  34.61,5.05 270 top
TSR  38.27,42.38 90 top
U1  19.05,16.35 0 bottom
U2  38.79,19.26 180 top
U3  33.28,57.14 0 top
U5  40.28,57.14 0 top
U6  15.24,55.72 90 bottom
U16  7.62,61.44 0 bottom
U$1  10,10.32 90 bottom
U$2  17.14,17.62 0 top
U$10  2.79,31.59 270 top
U$11  2.79,34.13 270 top
U$12  2.79,36.67 90 top
U$15  2.79,49.37 90 bottom
U$16  2.79,46.83 270 bottom
U$17  2.79,44.29 270 bottom
U$18  2.79,41.75 90 bottom
U$19  2.79,39.21 270 bottom
U$20  2.79,36.67 90 bottom
U$21  2.79,34.13 270 bottom
U$22  2.79,31.59 90 bottom
UART1  23.18,64.93 90 top
UART2  20.64,64.93 90 top
UART3  18.1,64.93 90 top
UART4  15.56,64.93 90 top
X1  43.59,37.15 0 bottom
XB1  18.48,15.4 180 top

### Tracks (layer width: path | path; a pad name or v marks a point on that pad's centre or on a via)
3.3V  (via drill 0.6)
  Top 0.254: U2.19 41.53,26.61 C26.2
  Top 0.305: 46.35,16.19 46.83,16.19 | 45.76,21.52 U2.13 41.53,21.52 39.53,19.52 v37.15,19.52 | U2.48 35.35,15.5 v35.56,15.71 | U2.64 42.55,11.94 C24.2 | U2.1 45.51,15.5 46.04,16.03 | U2.32 35.03,26.57 C19.2
  Top 0.406: IC1.61 7.81,42.23 v9.24,42.23 | 11.91,53.63 IC1.45 11.96,52.9 11.21,52.15 v10.94,52.15 | IC1.15 20.8,38.12 v20.8,39.58 | IC1.35 19.96,52.29 v19.84,52.18 | C29.2 48.16,16.72 47.62,16.19 46.83,16.19 46.2,16.19 46.04,16.03 44.13,14.13 44.13,10.48 43.55,9.9 42.97,9.9 C14.2 42.85,8.9 42.42,8.48 38.9,8.48 LED12.A LED13.A | IC1.53 9.16,48.68 v9.26,48.58 | 25.77,55.87 R15.1 25.64,56.03 | 25.07,52.23 v25.15,52.23 | R16.1 R13.1 | 30.32,55.82 R14.1 | 24.45,23.72 23.62,23.72 C3.+ | U$2.VDD 17.14,15.97 v16.7,15.52 | 45.76,21.52 45.88,21.52 v46.11,21.75 | 48.26,20.16 48.16,20.16 C31.2 | C16.2
  Top 0.61: C14.2 C24.2 | 27.5,46.28 IC1.25 21.96,46.28 v21.88,46.35 | 27.5,46.28 34.52,46.28 35.88,44.92 TSR.3 | C2.+ 27.5,46.28 | R16.1 v25.15,52.23 | R13.1 30.17,52.23 | 30.17,52.23 30.48,52.55 30.48,55.66 R14.1 | 25.07,52.23 23.98,53.33 23.98,54.3 25.71,56.03 R15.1 | U3.1 32.33,54.58 R18.2 | R18.2 32.46,54.45 | v38.81,54.27 39.33,54.79 | 39.33,54.79 U5.1 | 39.33,54.79 39.57,54.55 R20.2 | v31.75,52.24 30.48,52.24 | 30.48,52.24 30.17,52.24 30.17,52.23 | R18.2 32.42,54.18 30.48,52.24 | LED9.A LED8.A LED10.A LED11.A 1.87,17.78 2.54,17.11 6.19,17.11 XB1.14
  Top 0.813: C29.2 C31.2 48.16,21.26 | C16.2 | C19.2 | C19.2 C16.2 | C26.2 C15.2 41.26,30.46 v41.27,30.47 44.3,30.47 v44.45,30.32 | v44.45,30.32 48.16,26.61 C28.2 C17.2 48.16,21.77 | R2.2 R22.2 15.06,29.85 | 15.06,29.85 R21.2 R26.2 R27.2 | v34.72,30.95 34.7,30.98 v34.7,32.58 | C1.+ 37.85,28.79 40.39,28.79 | 24.45,23.72 24.45,22.76 v24.89,22.32 | v15.06,28.31 15.06,29.85 | 48.16,21.77 48.16,20.26 48.26,20.16 | v48.54,21.77 48.16,21.77 | v44.45,30.32 46.06,30.32 R29.2
  Top 1.016: C16.2 40.39,28.79 C15.2
  Top 1.27: C16.2 v34.72,30.95 34.72,42.81 36.83,44.92 TSR.3
  Bottom 0.406: C10.2 | C10.2 C8.2 | 12.54,51.02 C13.2 | 10.68,47.42 C5.2 10.45,47.42 | 10.36,42.23 C10.2 | 18.93,40.68 C12.2 | v37.15,19.52 37.13,19.51 C30.2 | v35.56,15.71 35.76,15.91 C27.2 | 9.3,58.26 9.3,59.76 U16.1 | R38.1 10.78,58.26 9.3,58.26 | U6.1 13.66,54.15 10.49,54.15 9.92,53.58 | 9.92,53.58 9.3,54.2 | 9.3,58.26 9.3,54.2 | R36.1 8.31,53.22 9.3,54.2 | U1.18 13.02,14.35 C20.2 | v20.8,39.58 20.8,40.94 | v10.94,52.15 9.92,53.17 9.92,53.58 | U1.4 26.08,16.75 26.98,17.64
  Bottom 0.61: 19.16,51.01 C6.2 | C6.2 15.51,51.01 | 16.13,42.16 13.43,39.46 11.18,39.46 10.77,39.87 C7.2 | v9.24,42.23 10.36,42.23 | 10.36,47.42 C5.2 10.41,47.42 v9.26,48.58 | 12.49,51 C13.2 12.42,51 11.27,52.15 v10.94,52.15 | 11.68,15.46 10.54,16.6 9.27,16.6 XB1.14 | U1.20 16.27,15.95 v16.7,15.52 16.7,15.27 16.58,15.15 | 11.68,15.46 11.68,20.03 13.04,21.39 13.04,26.34 15.01,28.31 v15.06,28.31 16.26,28.31 R4.2 | v25.15,52.23 21.91,52.23 21.59,51.91 21.59,50.95 C4.2 | v31.75,52.24 36.78,52.24 v38.81,54.27 | XB1.1 28.32,7.55 28.32,18.51 | U1.18 15.78,14.35 16.58,15.15 | 16.58,15.15 U1.6 24.58,15.15 24.58,15.25 26.98,17.64 28.08,18.75 | 11.68,15.46 12.47,14.68 C20.2 | 19.16,51.01 19.16,51.49 v19.84,52.18 | C6.2 15.13,51.01 15.85,50.28 15.85,42.44 16.13,42.16 | 20.33,45.38 20.5,45.56 21.09,45.56 v21.88,46.35 22.07,46.16 22.1,46.16 22.1,41.78 21.25,40.94 20.97,40.94 C23.2 20.8,40.94 | C25.2 19.37,50.79 19.16,51.01 | C11.2 20.33,45.38 | C22.2 20.33,45.13 20.33,45.38 | 16.13,42.16 17.18,41.11 C12.2 | 20.8,40.94 | 28.22,18.89 28.08,18.75 | 28.32,18.51 28.08,18.75 | 28.32,18.51 28.32,20.16
  Bottom 0.813: C13.2 C6.2 | C4.2 C25.2 | C5.2 C8.2 | C10.2 C7.2 | C12.2 C23.2 | v34.72,30.95 34.7,30.95 v34.7,32.58 | v34.72,30.95 v34.72,30.96 | C27.2 | C27.2 C30.2 | v34.72,30.95 33.53,30.95 28.22,25.65 28.22,22.7 | v24.89,22.32 27.84,22.32 28.22,22.7 | v46.11,21.75 46.13,21.77 v48.54,21.77 | 28.22,22.7 28.22,18.89
5V  (via drill 0.6)
  Top 0.406: L1.P$1 44.93,48.04 | R17.2 33.07,64.03
  Top 0.61: 33.07,64.03 33.97,64.93 OUT1.2 | R19.2 39.38,64.93 IN1.2
  Top 1.016: v44.45,50.64 v44.45,52.55 44.45,53.81 v43.81,54.45
  Top 1.27: C34.2 44.19,50.9 v44.45,50.64
  Top 1.676: v44.45,50.64 44.45,47.56 L1.P$1
  Bottom 0.406: v44.45,50.64 44.13,50.64 40.01,46.51 40.01,39.21 40.47,38.75 X1.1 | 32.78,64.93 28.85,61 22.63,61 20.55,58.92 18.48,58.92 R39.1 | 32.78,64.93 OUT1.2 | 32.78,64.93 32.78,65.05 31.65,66.19 12.04,66.19 11.39,66.83 R37.1
  Bottom 1.676: JUM8.1 JUM7.1 44.44,64.93 41.91,64.93 | OUT1.2 IN1.2 41.91,64.93 | 41.91,64.93 41.91,56.35 v43.81,54.45 44.45,53.81 v44.45,52.55 v44.45,50.64
ASSOC
  Bottom 0.406: XB1.15 8.64,15.24 8.64,8.56 R40.2
AUX1
  Top 0.406: IC1.58 6.72,44.68 5.21,46.2 5.21,48.1 3.94,49.37 AUX1.P$1
AUX2
  Top 0.406: AUX2.P$1 3.68,46.83 6.63,43.88 IC1.59
AUX3
  Top 0.406: AUX3.P$1 3.68,44.29 6.5,41.48 IC1.62
AUX4
  Top 0.406: IC1.63 6.15,40.68 5.08,41.75 AUX4.P$1
AUX5
  Top 0.406: IC1.64 6,39.88 5.33,39.21 AUX5.P$1
CD  (via drill 0.6)
  Top 0.406: v15.24,20.64 13.18,20.64 10.29,17.75 10.16,17.62 9.88,17.34 9.88,8.03 U$2.CD1
  Bottom 0.406: v15.24,20.64 v15.25,20.64 U1.25
CS  (via drill 0.6)
  Top 0.406: v18.41,13.68 19.34,14.61 U$2.DAT3
  Bottom 0.406: U1.14 17.85,13.12 v18.41,13.68
DN
  Bottom 0.406: X1.2 38.36,37.95 37.85,37.43 36.32,37.43 35.66,36.77 R1.1
DNUSB  (via drill 0.6)
  Top 0.305: U2.44 34.46,17.51 35.62,18.67 v35.62,19.09
  Bottom 0.406: 35.72,34.2 R1.2 35.81,34.11 35.81,19.29 v35.62,19.09
DP
  Bottom 0.406: X1.3 39,37.15 R3.1
DPUSB  (via drill 0.6)
  Top 0.305: U2.43 34.21,18.02 34.45,18.26 34.45,19.3 35.31,20.16 36.35,20.16 v37.15,20.95
  Bottom 0.406: v37.15,20.95 36.45,21.65 36.45,31.72 37.81,33.08 R3.2
DTR  (via drill 0.6)
  Top 0.406: v15.88,39.59 15.96,39.51 IC1.9
  Bottom 0.406: C21.2 15.88,34.92 v15.88,39.59
GND  (via drill 0.6)
  Top 0.254: 46.48,20.67 46.48,19.71 C31.1 | U2.12 45.5,21.02 45.59,20.92 | U2.18 42.04,25.78 42.96,26.7 C26.1
  Top 0.305: C32.1 38.21,26.83 v39.71,26.83 | 42.04,14.95 U2.63 42.04,12.67 41.27,11.9 | C17.1 46.83,23.12 | IC1.44 12.76,51.97 10.16,49.37 9.78,49.75 8.89,49.75 8.62,49.48 IC1.52 | 17.53,43.53 19.96,41.1 19.96,40.25 19.3,39.59 19.96,38.94 IC1.14 | 17.53,43.53 10.67,43.53 10.16,44.04 9.65,44.04 8.69,43.08 IC1.60 | 17.53,43.53 20.76,46.76 | 17.3,43.75 17.53,43.53 | 33.02,33.37 | IC1.34 20.76,52.74 21.28,52.22 21.28,49.12 | IC1.24 22.4,45.48 21.97,45.05 19.94,45.05 19.56,45.43 | 46.91,23.04 46.91,22.52 47.12,22.32 | 45.59,20.92 45.85,20.67 46.48,20.67
  Top 0.406: OUT1.3 IN1.3 | OUT1.3 I2C-1.3 I2C-2.3 UART1.3 UART2.3 UART3.3 UART4.3 PDI.3 10.3,67.47 S1.2 10.26,67.47 | 34.29,67.47 OUT1.3 | 46.83,23.12 46.91,23.04 | IC1.24 29.04,45.48 | 35.88,2.8 SWD.4 | 14.85,19.4 21.72,19.4 | 39.37,41.11 39.37,42.38 | U$2.CD2 11.7,18.16 12.68,19.14 | U$2.BODY2 11.09,13.32 11.09,13.4 11.79,14.09 11.79,14.57 | XB1.10 30.56,24.4 | 30.56,24.4 30.56,23.34 | 30.56,24.4 30.56,25.01 | 44.27,28.73 45,28 | 44.08,28.79 44.05,28.79
  Top 0.61: C16.1
  Top 0.813: S1.1 S1.2 | C29.1 C31.1 | C17.1 C28.1 | 33.02,34.77 33.02,33.37 C16.1 C19.1 | S2.2 S2.1 47.18,2.8 48.26,3.88 C18.1 | C19.1 | C26.1 C15.1 | 33.02,33.37 v33.02,34.51 | v31.62,44.67 v33.86,44.67
  Top 1.016: 46.35,25.24 46.35,26.51 46.46,26.41 C28.1 | 40.35,34.35 39.56,34.35
  Top 1.676: 39.37,42.38 37.21,42.38 36.58,41.75
  Bottom 0.305: 39.53,27.94 40.32,28.73
  Bottom 0.406: 24.77,17.55 U1.3 21.2,17.55 20.4,16.75 U1.21 13.52,16.75 13.14,16.38 C20.1 | 20.64,42.8 20.64,43.97 19.37,43.97 18.91,44.44 | C13.1 12.52,49.07 | 12.54,49.05 12.54,49.37 | 12.88,42.23 C10.1 C8.1 12.47,45.31 12.54,45.24 | 29.95,32.34 29.95,37.83 | 35.88,3.94 SWD.4 | 41.26,35.55 X1.5 39.5,35.55 39.5,34.38 | 17.94,49.21 19.25,49.21 | 19.68,17.37 20.7,18.38
  Bottom 0.813: C4.1 C25.1 | 14.29,49.3 C13.1 | C5.1 12.54,47.35 12.54,45.24 | C12.1 C23.1 | 33.02,42 33.27,41.75
  Bottom 1.676: 33.66,42.38 38.61,42.38
  other vias: 17.1,46.09 14.38,45.13 42.04,15.21 39.05,21.43 39.59,10.41 21.74,13.63 20.68,19.09 22.73,10.38 42.04,17.49 34.04,49.12 3.05,52.42 47.24,51.91 7.87,29.18 25.02,30.83 48.26,29.05 29.97,31.72 48.26,8.73 29.97,30.19 44.39,25.02
  pour Bottom (isolate 0.3, rank 4): 0,-0.16 50.04,-0.16 50.04,69.94 0,69.94
  pour Top (isolate 0.3, rank 4): 0,-0.16 50.04,-0.16 50.04,69.94 0,69.94
IN1
  Top 0.61: SC3.MID 39.05,61.63 IN1.1
IN1_C
  Top 0.406: IC1.30 33.42,50.28 34.54,51.4 37.91,51.4 SC4.MID
LED1
  Top 0.406: LED1.C 13.56,35.97 IC1.6
LED2
  Top 0.406: LED2.C 16.76,36.58 IC1.10
LED3
  Top 0.406: LED3.C 15.16,36.28 IC1.8
LED4
  Top 0.406: LED4.C 18.36,36.89 IC1.12
LED5
  Top 0.406: R24.1 10.36,37.08 IC1.2
LED6
  Top 0.406: R25.1 9.19,38.08 IC1.1
LED7
  Top 0.406: R23.1 11.16,36.52 IC1.3
LED8
  Top 0.406: LED5.C 20.1,37.05 19.43,37.05 19.16,37.32 IC1.13 19.16,37.58
MISO  (via drill 0.6)
  Top 0.406: U$2.DAT0 13.85,15.34 11.72,13.21 v11.72,11.87
  Bottom 0.406: 16.19,12 U1.16 16.25,11.64
  Bottom 0.61: U1.16 16.06,11.87 v11.72,11.87 10.99,11.87 U$1.2
MOSI  (via drill 0.6)
  Top 0.406: v16.89,13.68 18.25,15.04 U$2.CMD
  Bottom 0.406: v16.89,13.68 17.05,13.52 U1.15 17.05,11.18 16.56,10.69 10.37,10.69 U$1.1
N$1
  Bottom 0.406: Q1.3 24.11,10.91 23.75,11.27 23.75,13.14 U1.8
N$2
  Bottom 0.406: U1.7 25.09,14.35 Q1.1
N$3
  Top 0.406: 13.59,33.58 LED1.A
  Top 0.61: R2.1 11.56,32.1 13.3,33.84 LED1.A
N$4
  Top 0.61: R25.2 6.18,34.42 5.84,34.77 5.84,35.78 4.95,36.67 4.19,36.67
  Top 0.813: 4.19,36.67 U$12.P$1
N$5
  Top 0.406: UART1.2 24.45,63.66 24.45,60.38 R5.1
N$6
  Top 0.61: R6.1 21.75,60.96 UART1.1
N$7
  Top 0.61: R22.1 13.72,32.1 15.46,33.84 LED3.A
N$8
  Top 0.61: U3.3 33.34,58.41 SC2.1 33.07,60.11 R17.1
N$9
  Top 0.61: U3.2 34.24,54.6 R18.1 34.06,54.42 34.06,53.84 33.34,53.12 SC1.1
N$10
  Top 0.406: R10.1 18,59.74 UART2.1
N$11  (via drill 0.6)
  Top 0.61: R9.1 19.68,59.78 v20.07,60.16
  Bottom 0.406: UART2.2 19.38,63.67 19.38,60.85 v20.07,60.16
N$12
  Top 0.406: R12.1 14.8,61.05 17.4,61.05 18.1,61.75 UART3.1
N$13  (via drill 0.6)
  Top 0.61: R11.1 15.85,58.77
  Top 0.813: 15.85,58.77 v15.85,60.01
  Bottom 0.406: UART3.2 16.82,63.65 16.82,60.9 15.93,60.01 v15.85,60.01
N$14
  Top 0.406: 10.07,25.62 R30.1 10.2,25.49 6.6,25.49 5.33,24.22 LED8.C
N$15
  Top 0.61: U5.2 42.06,55.37 R20.1 42.06,54.14 40.46,52.55 SC4.1
N$16
  Bottom 0.406: 6.53,60.34 U16.2 6.67,59.57 SC5.1 7.14,55.43 R36.2
N$17
  Top 0.406: 47.66,35.91 R28.1
  Top 0.61: 47.66,35.91 LED6.A
N$18
  Top 0.61: R21.1 15.88,32.1 17.4,33.62 LED2.A
N$19
  Top 0.406: R29.1 47.66,33.62
  Top 0.61: 47.66,33.62 LED7.A
N$20
  Top 0.61: R26.1 17.91,32.1 19.3,33.5 LED4.A
N$21
  Top 0.406: LED9.C 4.1,26.38 9.56,26.38 R31.1 10.2,27.02
N$22
  Bottom 0.406: R38.2 11.21,56.46 SC7.1 13.2,56.67 U6.2
N$23
  Bottom 0.406: U16.3 7.87,62.96 SC6.MID 9.37,64.55 R37.2
N$24
  Top 0.254: 6.86,21.38 8.13,21.38
  Top 0.406: R32.1 14.26,22.95 9.78,22.95 8.2,21.38 8.13,21.38 | LED10.C 4.55,21.38 6.86,21.38
N$25
  Bottom 0.406: U6.3 16.51,56.99 | 16.51,56.99 15.14,58.36 SC8.MID | 16.51,56.99 17.18,57.66 R39.2
N$26
  Top 0.254: 6.99,19.4 8.26,19.4
  Top 0.406: LED11.C 4.61,19.4 6.99,19.4 | 8.26,19.4 10.92,19.4 13.21,21.68 16.42,21.68 R33.1 16.55,21.56
N$27  (via drill 0.6)
  Top 0.406: LED12.C v34.16,9.37
  Bottom 0.406: v34.16,9.37 31.37,12.16 31.37,20.58 R34.1
N$28  (via drill 0.6)
  Top 0.406: LED13.C 34.54,11.27 v34.16,10.89
  Bottom 0.406: v34.16,10.89 32,13.05 32,18.76 33.66,20.41 R35.1
N$29
  Top 0.61: R27.1 19.94,32.1 21.21,33.37 LED5.A
N$30
  Top 0.61: U5.3 40.32,58.41 SC3.1 40.75,60.27 R19.1
N$31
  Top 0.406: SC3.2 SC4.2
N$32
  Top 0.305: U$10.P$1 3.17,31.97
  Top 0.61: 3.17,31.97 9.53,31.97 11.56,34 R23.2
N$33  (via drill 0.6)
  Top 0.406: LED14.A v5.59,4.41
  Bottom 0.406: v5.59,4.41 8.22,4.41 R40.1
N$34
  Top 0.406: SC1.2 SC2.2
N$35  (via drill 0.6)
  Top 0.406: RSSI.A v5.59,2.38
  Bottom 0.406: R41.1 22.64,2.38 v5.59,2.38
N$36
  Top 0.61: R24.2 9.4,33.88 8.51,32.99 5.97,32.99 4.83,34.13 U$11.P$1
N$37  (via drill 0.6)
  Top 0.61: v31.37,3.78 29.78,3.78 LED15.A
  Bottom 0.406: R42.1 35.27,7.59 32.64,7.59 32,6.95 32,4.41 v31.37,3.78
NRST
  Top 0.305: U2.7 43.42,18.5 43.18,18.26 43.18,16.73 42.67,16.22 41.12,16.22 39.59,14.7 34.67,14.7 34.29,14.32 34.29,13.56 | 32.13,7.08 32.13,5.55 32.64,5.05 34.61,5.05
  Top 0.406: SWD.2 34.61,5.05 | 32.13,7.08 32.13,11.4 34.29,13.56
  Top 0.813: SWD.2 36.86,7.3 S2.4 S2.3 47.18,7.3 48.26,6.21 C18.2
OUT1
  Top 0.406: SC1.MID 33.14,51.08 IC1.31
OUT1_C
  Top 0.61: SC2.MID 34.61,61.5 OUT1.1
PDI_CLK
  Top 0.406: IC1.57 6.75,45.48 5.87,46.35 5.87,52.96 6.35,53.43 6.35,57.24 7.11,58.01 7.11,61.41 8.64,62.93 | 5.87,62.93 S1.3
  Top 0.813: PDI.2 11.62,64.93 10.26,63.57 S1.4 8.64,62.93 S1.3
PDI_DATA
  Top 0.254: 8.99,61.92 9.07,61.99 11.43,61.99 11.82,62.39 12.26,62.39
  Top 0.406: IC1.56 6.9,46.28 6.51,46.67 6.51,52.58 7.11,53.18 7.11,56.99 7.87,57.75 7.87,60.8 8.99,61.92 | 12.26,62.39 PDI.1
RSSI
  Bottom 0.406: XB1.6 30.61,15.27 30.61,5.81 29.59,4.79 R41.2
RST  (via drill 0.6)
  Top 0.406: v11.68,21.68 12.32,22.32 17.91,22.32 v18.41,22.83
  Bottom 0.305: v18.41,22.83 19.32,22.83 19.45,22.7 | 10,17.97 11.05,19.02 11.05,21.05 v11.68,21.68
  Bottom 0.406: U$1.4 10,17.97 | U1.29 19.45,22.7 19.45,27.66 R4.1
  Bottom 0.61: R4.1 18.38,30.71 C21.1
RXD1
  Top 0.406: IC1.18 26.47,40.68 27.94,39.21 27.94,34.38 26.54,32.99 26.54,27.53 26.54,27.14 | 26.54,27.14 26.54,27.02 12.41,27.02 arc-90 R31.2 | XB1.2 27.05,10.82 27.05,26.64 26.54,27.14
RXD2  (via drill 0.6)
  Top 0.305: 42.67,22.19 42.86,22.01 U2.14
  Top 0.406: 32.13,24.48 30.99,25.62 30.99,41.5 28.61,43.88 IC1.22 | 32.13,24.48 33.15,24.48 34.92,22.7 42.16,22.7 42.67,22.19 | v31.62,24.48 32.13,24.48
  Bottom 0.61: R34.2 31.75,24.35 v31.62,24.48
RXD3  (via drill 0.6)
  Top 0.406: v24.77,48.42 24.5,48.68 IC1.28
  Top 0.61: v23.97,38.73 24.13,38.58 24.13,36.8 22.61,35.27 22.61,33.11 21.46,31.97 v21.46,28.45 | R33.2 19.77,22.32 v21.72,22.32
  Bottom 0.305: 21.05,22.11 21.26,22.32 v21.72,22.32
  Bottom 0.406: v24.77,48.42 25.08,48.1 25.08,39.84 v23.97,38.73 | 21.05,22.11 U1.31 | v21.46,28.45 20.95,27.94 20.95,25.24 21.72,24.48 v21.72,22.32
RXD4
  Top 0.406: IC1.32 22.54,52.69 22.54,56.77 R5.2
RXD5
  Top 0.406: IC1.38 17.56,56.26 18.03,56.74 19.65,56.74 R9.2
RXD6
  Top 0.406: IC1.42 14.36,55.58 R11.2
RXD7  (via drill 0.6)
  Top 0.406: 11.38,56.56 R7.2 11.38,55.92 v10.64,55.19 10.26,55.19 9.56,54.48 IC1.48
  Bottom 0.406: 12.95,55.21 SC7.MID v10.64,55.19
RXD77  (via drill 0.6)
  Top 0.406: UART4.2 14.25,63.62 14.25,61.64 13.44,60.83 12.27,60.83 11.86,60.42 v11.86,60.09 11.86,59.03 R7.1
  Bottom 0.61: SC8.1 12.32,59.63 v11.86,60.09
SCK  (via drill 0.6)
  Top 0.406: U$2.CLK 16.05,16.52 13.4,13.88 v13.4,13.14
  Bottom 0.406: U1.17
  Bottom 0.61: U1.17 14.35,13.14 v13.4,13.14 12.26,13.14 U$1.3
SCL1  (via drill 0.6)
  Top 0.406: IC1.17 23.39,39.84 25.78,39.84 26.92,38.7 v26.92,37.3 | 29.72,58.13 R14.2
  Top 0.61: I2C-1.2 29.65,63.53 v29.65,59.91 29.65,58.19 R14.2
  Bottom 0.61: v26.92,37.3 29.65,40.03 v29.65,59.91
SCL2  (via drill 0.6)
  Top 0.406: I2C-2.2 26.99,63.66 26.99,61.12 | IC1.37 18.36,54.98 v18.62,55.24
  Top 0.61: 26.99,61.12 27.18,60.93 27.18,54.12 27,53.94 | 26.98,53.94 27,53.94 | 27,53.94 26.99,53.94 R16.2 26.85,53.94 v25.22,53.94
  Bottom 0.61: v25.22,53.94 19.56,53.94 18.62,54.88 v18.62,55.24
SDA1  (via drill 0.6)
  Top 0.406: IC1.16 22.01,37.62 v23.02,37.62
  Top 0.61: I2C-1.1 28.26,56.07 v28.38,55.94 28.38,54.44 R13.2
  Bottom 0.406: 26.67,38.58 25.72,37.62
  Bottom 0.61: v28.38,55.94 28.38,40.29 26.67,38.58 | v23.02,37.62 25.72,37.62
SDA2  (via drill 0.6)
  Top 0.406: IC1.36 19.16,54.3 20.07,55.21 v20.45,55.21 | v23.74,55.99 25.48,57.73 R15.2
  Top 0.61: R15.2 25.72,57.78 I2C-2.1
  Bottom 0.61: v20.45,55.21 22.96,55.21 v23.74,55.99
STLED  (via drill 0.6)
  Top 0.305: U2.10 42.41,20.02 v41.91,19.52
  Bottom 0.406: R42.2 40.64,14.66 40.64,18.26 v41.91,19.52
SWCLK
  Top 0.305: 34.8,13.18 35.03,13.41 U2.49
  Top 0.406: SWD.1 32.77,6.89 32.77,11.14 34.8,13.18
SWDIO  (via drill 0.6)
  Top 0.305: U2.46 34.94,16.52 v35.56,17.14
  Top 0.406: SWD.3 33.02,3.78 31.5,5.3 31.5,11.65 33.08,13.23 v33.08,14.38
  Bottom 0.406: v35.56,17.14 33.08,14.66 v33.08,14.38
TSR_VIN
  Top 0.61: C35.2 44.08,40.73 47.12,37.69 47.59,37.69 R28.2
  Top 1.27: C35.2 44.08,44.34 L1.P$2 | 44.08,40.73 43.19,39.84 TSR.1
TXD1  (via drill 0.6)
  Top 0.406: IC1.19 26.69,41.48 28.7,39.46 28.7,34.13 27.43,32.86 27.43,28.16 v27.84,27.75 27.69,27.6 27.69,12.19 XB1.3 | R30.2 12.66,25.75 13.36,25.75 13.99,26.38 25.53,26.38 v25.96,25.95
  Bottom 0.406: v25.96,25.95 26.04,25.95 v27.84,27.75
TXD2  (via drill 0.6)
  Top 0.305: U2.15 43.24,22.51 43.05,22.7
  Top 0.406: 33.27,25.24 32.38,25.24 31.75,25.88 31.75,41.75 28.82,44.68 IC1.23 | 43.05,22.7 42.29,23.46 35.05,23.46 33.27,25.24 | 33.27,25.24 v33.91,25.24
  Bottom 0.61: R35.2 33.66,24.99 v33.91,25.24
TXD3  (via drill 0.6)
  Top 0.305: 16.73,23.84 R32.2
  Top 0.406: IC1.29 25.7,49.48 v25.96,49.22
  Top 0.61: v25.4,38.73 25.15,38.48 25.15,36.29 23.62,34.77 23.62,32.73 22.67,31.78 v22.67,29.65 | R32.2 16.98,23.97 v20.57,23.97
  Bottom 0.406: v25.4,38.73 25.72,39.05 25.7,39.06 25.96,39.32 v25.96,49.22 | U1.30 20.25,23.77 20.45,23.97 v20.57,23.97 20.32,24.22 20.32,29.05 20.92,29.65 v22.67,29.65
TXD4
  Top 0.406: IC1.33 21.56,57.85 R6.2
TXD5
  Top 0.406: IC1.39 16.76,57.18 R10.2
TXD6
  Top 0.406: IC1.43 13.56,57.98 R12.2
TXD7  (via drill 0.6)
  Top 0.406: IC1.49 8.26,52.38 v8.26,56.48 8.26,57.06 R8.2
  Bottom 0.406: v8.26,56.48 8.26,58.95 SC5.MID
TXD77  (via drill 0.6)
  Top 0.406: 9.54,59.74 R8.1 10.47,60.98 v10.77,60.98
  Bottom 0.406: SC6.1 10.64,61.1 v10.77,60.98 10.92,60.98 11.18,61.23 12.17,61.23 12.62,60.77 13.95,60.77 UART4.1
VCAP_1
  Top 0.305: U2.31 35.54,25.7 36.46,26.61 C32.2
VCAP_2
  Top 0.305: U2.47 31.46,16.01
  Top 0.61: 31.46,16.01 31.46,16.14 C33.2
XB_RESET
  Top 0.406: IC1.20 26.9,42.28 29.46,39.72 29.46,33.88 28.19,32.61 28.19,29.05 28.96,28.29 28.96,25.98 28.27,25.29 28.27,15.61 XB1.5

### Text on the board
tPlace: OBC RESET | <GND> | <GND> | + | + | 5V | + | + | +5V PWR | DIRECT / 3.3V IN / MAXIMUM! | XMEGA OBC | 5V PWR | LED1-5 | 3.3V PWR | LED ext / 1-3 | XBEE TX | XBEE RX | LOG RX | STM | LOG TX | STM RX | Multirotor / control / board v2.0 / Tomas Baca | STM TX | ASSOC | ST LINK | STM RESET | RSSI | STLED
bPlace: GND | GND | RST | SCK | MISO | MOSI
tValues: 8.2uH | 8.2uH | ATXmega128a3u | TSR 1-2433 | STM32F415 / RGT6
bValues: 100nF | 1nF | 100nF | 1nF | 1nF | 1nF | 100nF | 100nF | 1nF | 1nF | 100nF | 100nF